# Altium schematic sheet Peripherals.SchDoc: Peripherals
size Letter; Date: 2017-02-17; Revision: A; SheetNumber: 8; SheetTotal: 11; ProjectTitle: PDUv17: Power Distribution Unit
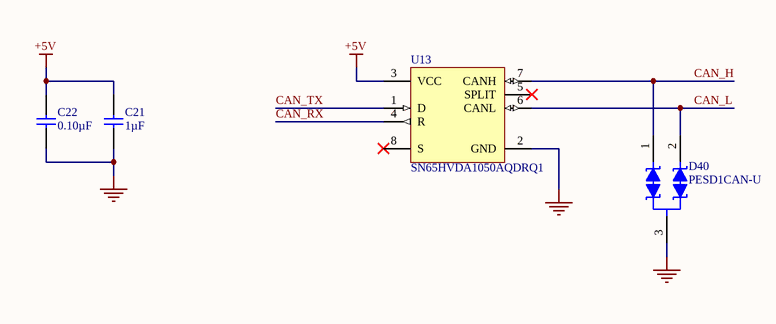
[diagram p0: Peripherals.SchDoc]

## Parts
C21  value 1µF  [CAP-0805-M]  (hidden comment: CAP 1µF ±10% 16V 0805 X7R)
C22  value 0.10µF  [CAP-0402-M]  (hidden comment: CAP 0.10µF ±10% 16V 0402 X7R)
D40  PESD1CAN-U  [SOT65P210X110-3N]
U13  SN65HVDA1050AQDRQ1  [SOIC127P600X175-8M]

## Nets
+5V: C21.1 C22.2 U13.3(VCC)
GND: C21.2 C22.1 D40.3 U13.2(GND)
CAN_H: D40.1 U13.7(CANH)
CAN_L: D40.2 U13.6(CANL)
CAN_RX: U13.4(R)
CAN_TX: U13.1(D)

Not connected (* = marked no-connect by the designer): U13 5(SPLIT)* 8(S)*

## Notes on the sheet
- Date:
- Revision:
- Sheet:
- /

## Library data of the parts
C21 = CC0805KKX7R7BB105: Manufacturer: Yageo; Manufacturer Series: CC; Part Number: CC0805KKX7R7BB105; Component Type: Standard; Tolerance: ±10%; Voltage: 16V; Package: 0805; Temperature Coefficient: X7R; Temperature Range: -55°C ~ 125°C; Supplier 1: Digi-Key; Supplier Part Number 1: 311-1365-1-ND
C22 = CC0402KRX7R7BB104: Manufacturer: Yageo; Manufacturer Series: CC; Part Number: CC0402KRX7R7BB104; Component Type: Standard; Tolerance: ±10%; Voltage: 16V; Package: 0402; Temperature Coefficient: X7R; Temperature Range: -55°C ~ 125°C; Supplier 1: Digi-Key; Supplier Part Number 1: 311-1338-1-ND
U13 = SN65HVDA1050AQDRQ1: CAN transceiver; Supplier 1: Digi-Key; Supplier Part Number 1: 296-25836-1-ND